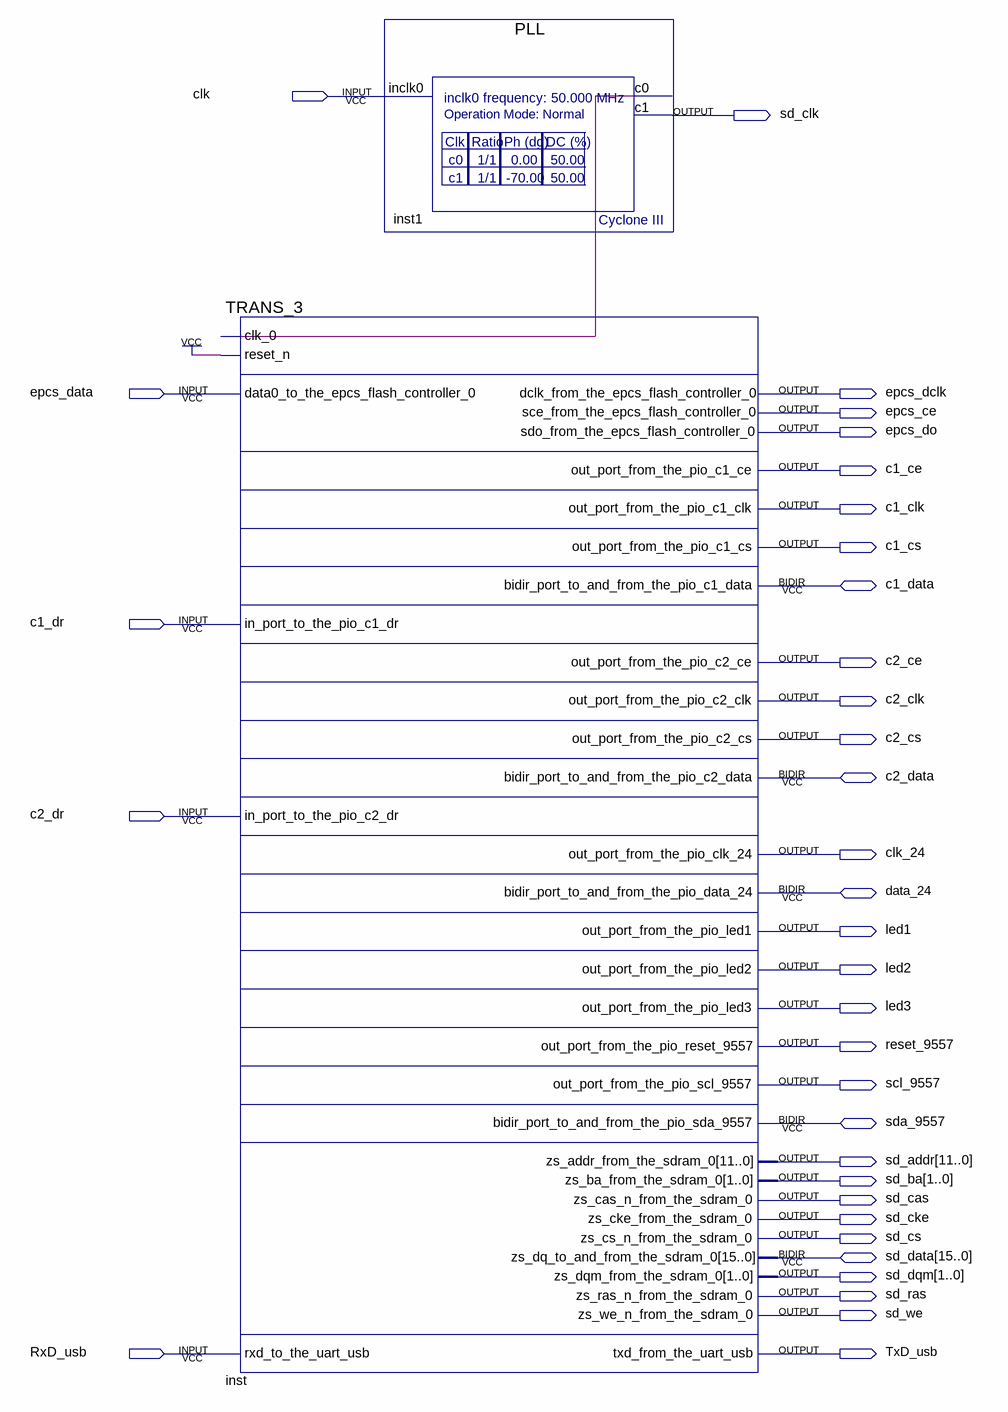
[diagram p0: schematic sheet]
// Quartus schematic TRANS_CL3.bdf as structural Verilog: 2 symbols, 35 pins
module TRANS_CL3 (
  input  clk,
  input  epcs_data,
  input  c1_dr,
  input  c2_dr,
  input  RxD_usb,
  inout  c1_data,
  inout  c2_data,
  inout  data_24,
  inout  sda_9557,
  inout  [15:0] sd_data,
  output sd_clk,
  output epcs_dclk,
  output epcs_ce,
  output epcs_do,
  output c1_ce,
  output c1_clk,
  output c1_cs,
  output c2_ce,
  output c2_clk,
  output c2_cs,
  output clk_24,
  output led1,
  output led2,
  output led3,
  output reset_9557,
  output scl_9557,
  output [11:0] sd_addr,
  output [1:0] sd_ba,
  output sd_cas,
  output sd_cke,
  output sd_cs,
  output [1:0] sd_dqm,
  output sd_ras,
  output sd_we,
  output TxD_usb
);

  wire inst1_c0;

  TRANS_3 inst (
    .clk_0(inst1_c0), .reset_n(1'b1), .data0_to_the_epcs_flash_controller_0(epcs_data),
    .in_port_to_the_pio_c1_dr(c1_dr), .in_port_to_the_pio_c2_dr(c2_dr), .rxd_to_the_uart_usb(RxD_usb),
    .dclk_from_the_epcs_flash_controller_0(epcs_dclk), .sce_from_the_epcs_flash_controller_0(epcs_ce),
    .sdo_from_the_epcs_flash_controller_0(epcs_do), .out_port_from_the_pio_c1_ce(c1_ce),
    .out_port_from_the_pio_c1_clk(c1_clk), .out_port_from_the_pio_c1_cs(c1_cs),
    .out_port_from_the_pio_c2_ce(c2_ce), .out_port_from_the_pio_c2_clk(c2_clk),
    .out_port_from_the_pio_c2_cs(c2_cs), .out_port_from_the_pio_clk_24(clk_24),
    .out_port_from_the_pio_led1(led1), .out_port_from_the_pio_led2(led2), .out_port_from_the_pio_led3(led3),
    .out_port_from_the_pio_reset_9557(reset_9557), .out_port_from_the_pio_scl_9557(scl_9557),
    .zs_addr_from_the_sdram_0(sd_addr), .zs_ba_from_the_sdram_0(sd_ba), .zs_cas_n_from_the_sdram_0(sd_cas),
    .zs_cke_from_the_sdram_0(sd_cke), .zs_cs_n_from_the_sdram_0(sd_cs), .zs_dqm_from_the_sdram_0(sd_dqm),
    .zs_ras_n_from_the_sdram_0(sd_ras), .zs_we_n_from_the_sdram_0(sd_we), .txd_from_the_uart_usb(TxD_usb),
    .bidir_port_to_and_from_the_pio_c1_data(c1_data), .bidir_port_to_and_from_the_pio_c2_data(c2_data),
    .bidir_port_to_and_from_the_pio_data_24(data_24), .bidir_port_to_and_from_the_pio_sda_9557(sda_9557),
    .zs_dq_to_and_from_the_sdram_0(sd_data));
  PLL inst1 (.inclk0(clk), .c0(inst1_c0), .c1(sd_clk));
endmodule
